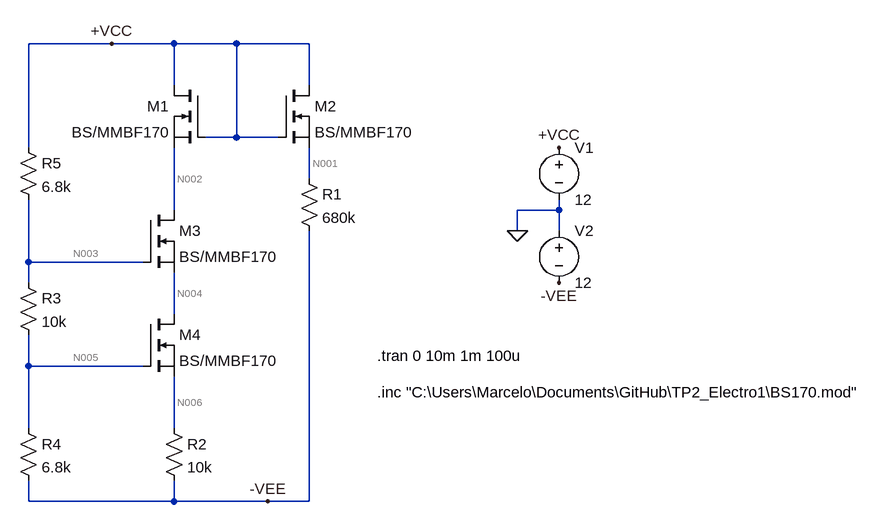
[diagram p0: schematic Cascode.asc]
Cascode.asc, the LTspice schematic file:
Version 4
SHEET 1 1240 748
WIRE 48 0 -80 0
WIRE 144 0 48 0
WIRE 240 0 144 0
WIRE 352 0 240 0
WIRE 144 64 144 0
WIRE 352 64 352 0
WIRE 240 144 240 0
WIRE 240 144 192 144
WIRE 304 144 240 144
WIRE -80 160 -80 0
WIRE 352 208 352 160
WIRE 144 256 144 160
WIRE 736 256 736 240
WIRE 736 256 672 256
WIRE 672 288 672 256
WIRE 736 288 736 256
WIRE -80 336 -80 240
WIRE 96 336 -80 336
WIRE -80 368 -80 336
WIRE 144 416 144 352
WIRE -80 496 -80 448
WIRE 96 496 -80 496
WIRE -80 592 -80 496
WIRE 144 592 144 512
WIRE -80 704 -80 672
WIRE 144 704 144 672
WIRE 144 704 -80 704
WIRE 288 704 144 704
WIRE 352 704 352 288
WIRE 352 704 288 704
FLAG 672 288 0
FLAG 736 160 +VCC
FLAG 736 368 -VEE
FLAG 48 0 +VCC
FLAG 288 704 -VEE
SYMBOL nmos 192 64 M0
SYMATTR InstName M1
SYMATTR Value BS/MMBF170
SYMBOL nmos 304 64 R0
SYMATTR InstName M2
SYMATTR Value BS/MMBF170
SYMBOL nmos 96 256 R0
SYMATTR InstName M3
SYMATTR Value BS/MMBF170
SYMBOL nmos 96 416 R0
SYMATTR InstName M4
SYMATTR Value BS/MMBF170
SYMBOL voltage 736 144 R0
WINDOW 123 0 0 Left 2
WINDOW 39 0 0 Left 2
SYMATTR InstName V1
SYMATTR Value 12
SYMBOL voltage 736 272 R0
WINDOW 123 0 0 Left 2
WINDOW 39 0 0 Left 2
SYMATTR InstName V2
SYMATTR Value 12
SYMBOL res 336 192 R0
SYMATTR InstName R1
SYMATTR Value 680k
SYMBOL res 128 576 R0
SYMATTR InstName R2
SYMATTR Value 10k
SYMBOL res -96 352 R0
SYMATTR InstName R3
SYMATTR Value 10k
SYMBOL res -96 576 R0
SYMATTR InstName R4
SYMATTR Value 6.8k
SYMBOL res -96 144 R0
SYMATTR InstName R5
SYMATTR Value 6.8k
TEXT 456 480 Left 2 !.tran 0 10m 1m 100u
TEXT 456 536 Left 2 !.inc "C:\\Users\\Marcelo\\Documents\\GitHub\\TP2_Electro1\\BS170.mod"

The netlist it stands for:
* Cascode.asc
M1 +VCC +VCC N002 N002 BS/MMBF170
M2 +VCC +VCC N001 N001 BS/MMBF170
M3 N002 N003 N004 N004 BS/MMBF170
M4 N004 N005 N006 N006 BS/MMBF170
V1 +VCC 0 12
V2 0 -VEE 12
R1 N001 -VEE 680k
R2 N006 -VEE 10k
R3 N003 N005 10k
R4 N005 -VEE 6.8k
R5 +VCC N003 6.8k
.model NMOS NMOS
.model PMOS PMOS
.lib standard.mos
.tran 0 10m 1m 100u
.inc "C:\Users\Marcelo\Documents\GitHub\TP2_Electro1\BS170.mod"
.backanno
.end

* Results of the author's LTspice run, read from the files saved beside the schematic
* Operating Point, zero values left out:
*   V(+vcc) = 12 V
*   V(n002) = 7.297 V
*   V(n001) = 10.19 V
*   V(n003) = 5.085 V
*   V(n004) = 381.5 mV
*   V(n005) = -5.085 V
*   V(n006) = -9.788 V
*   V(-vee) = -12 V
*   Id(M4) = 221.2 µA
*   Ib(M4) = -10.18 pA
*   Is(M4) = -221.2 µA
*   Id(M3) = 221.2 µA
*   Ib(M3) = -6.925 pA
*   Is(M3) = -221.2 µA
*   Id(M2) = 32.64 µA
*   Ib(M2) = -1.817 pA
*   Is(M2) = -32.64 µA
*   Id(M1) = 221.2 µA
*   Ib(M1) = -4.713 pA
*   Is(M1) = -221.2 µA
*   I(R5) = 1.017 mA
*   I(R4) = 1.017 mA
*   I(R3) = 1.017 mA
*   I(R2) = 221.2 µA
*   I(R1) = 32.64 µA
*   I(V2) = -1.271 mA
*   I(V1) = -1.271 mA